# EAGLE schematic controller_rev3 (EAGLE 8.6.0)

## Sheet 1 of 3: Controller
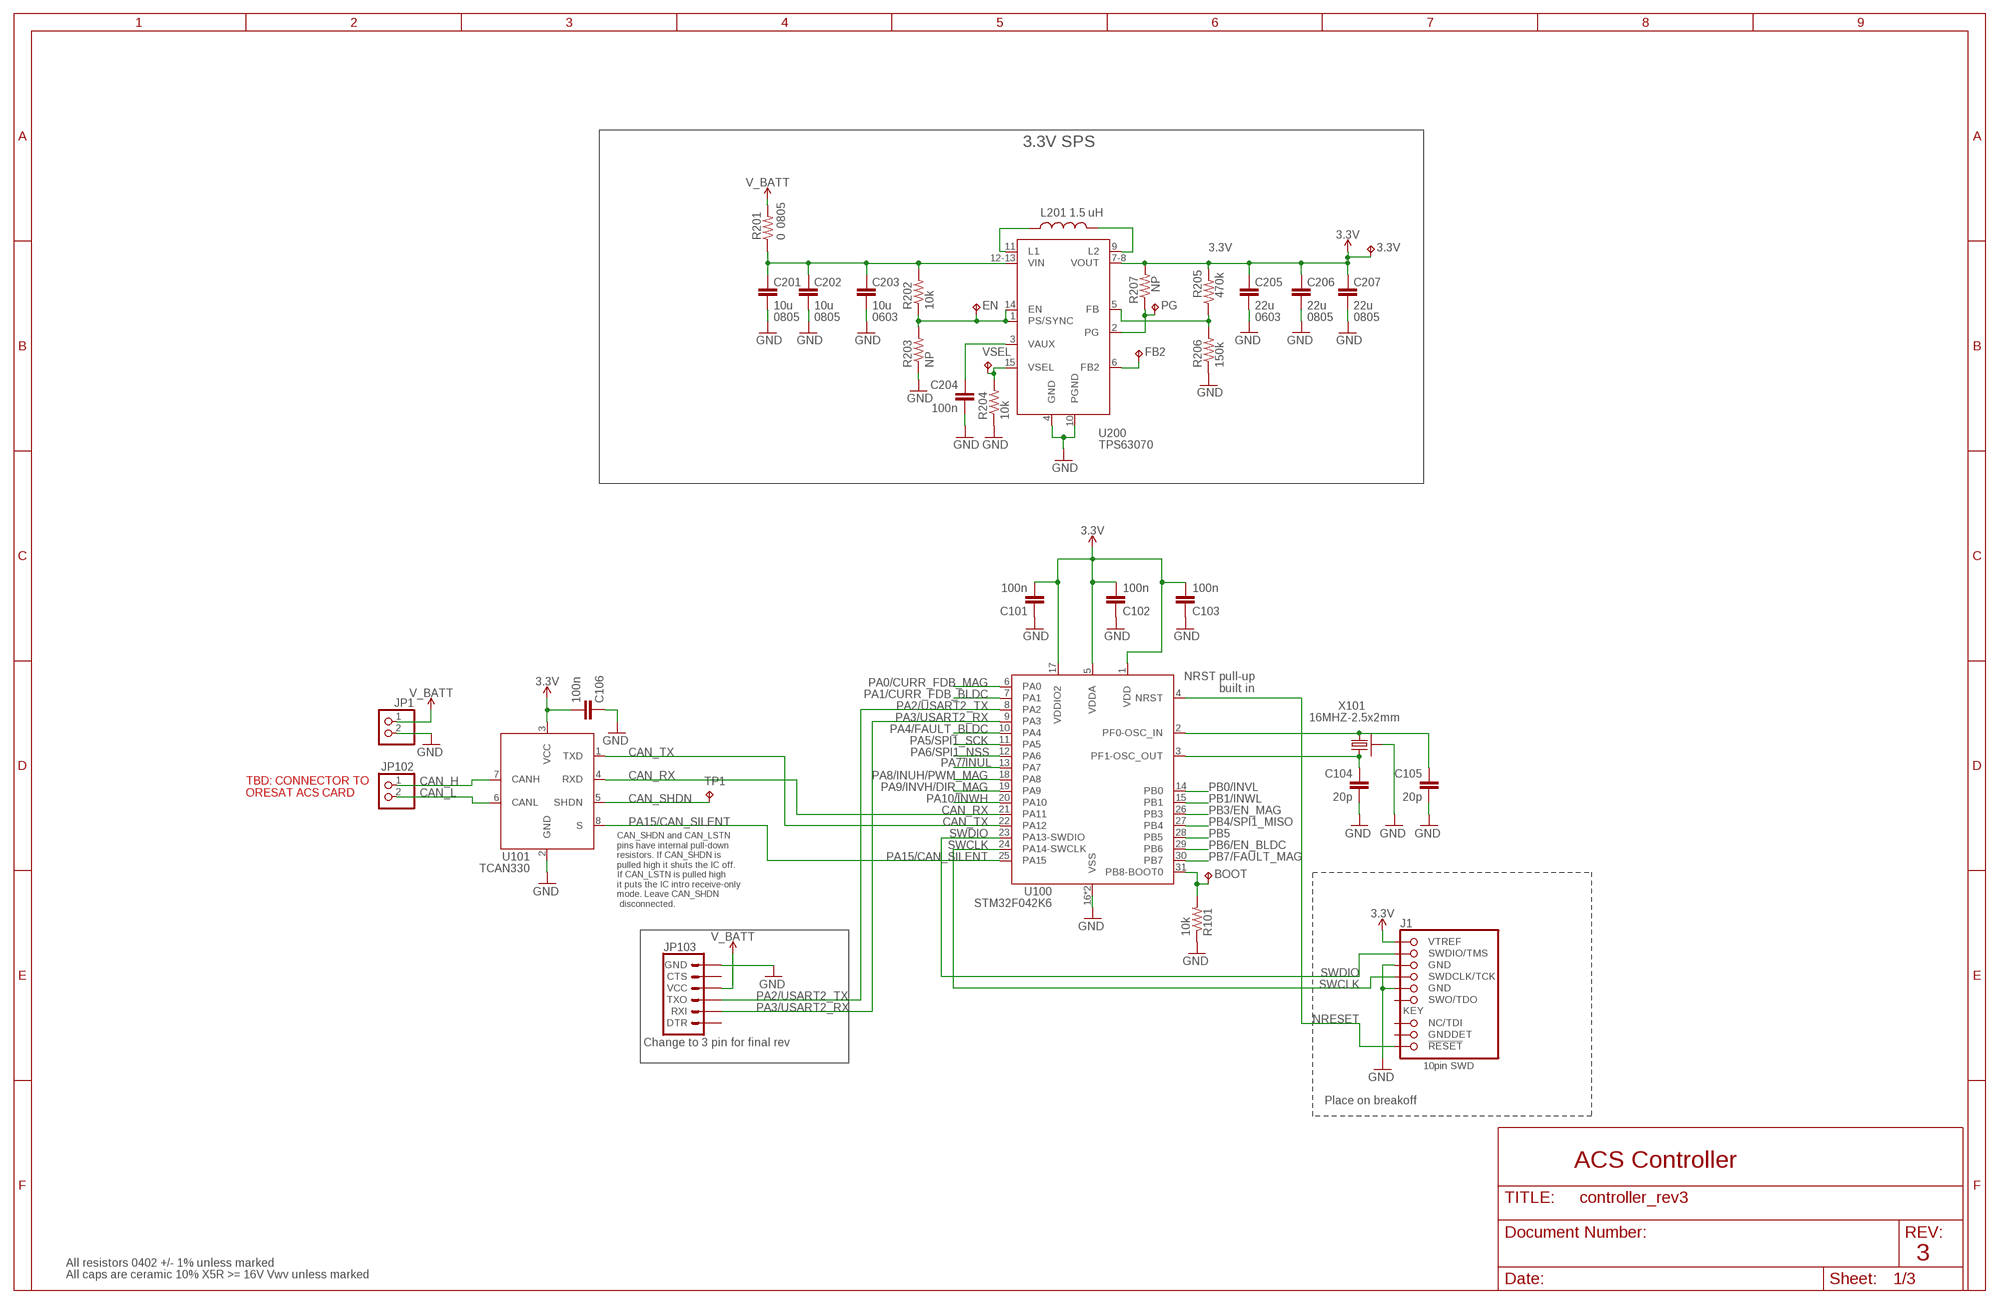
[diagram p0: schematic, sheet 1]

### Parts
3.3V  TPTP15SQ  [TP15SQ]
BOOT  TPTP15SQ  [TP15SQ]
C101  100n  C-EU0402-B-NOSILK  [.0402-B-NOSILK]
C102  100n  C-EU0402-B-NOSILK  [.0402-B-NOSILK]
C103  100n  C-EU0402-B-NOSILK  [.0402-B-NOSILK]
C104  20p  C-EU0402-B-NOSILK  [.0402-B-NOSILK]
C105  20p  C-EU0402-B-NOSILK  [.0402-B-NOSILK]
C106  100n  C-EU0402-B-NOSILK  [.0402-B-NOSILK]
C201  10u  C-EU0805-B-NOSILK  [.0805-B-NOSILK]
C202  10u  C-EU0805-B-NOSILK  [.0805-B-NOSILK]
C203  10u  C-EU0603-B-NOSILK  [.0603-B-NOSILK]
C204  100n  C-EU0402-B-NOSILK  [.0402-B-NOSILK]
C205  22u  C-EU0603-B-NOSILK  [.0603-B-NOSILK]
C206  22u  C-EU0805-B-NOSILK  [.0805-B-NOSILK]
C207  22u  C-EU0805-B-NOSILK  [.0805-B-NOSILK]
EN  TPTP15SQ  [TP15SQ]
FB2  TPTP15SQ  [TP15SQ]
J1  1.27MM-SWD-CONNECTOR  [1.27MM_2X5]
JP1  PINHD-1X2  [1X02]
JP102  PINHD-1X2  [1X02]
JP103  6_PIN_SERIAL_TARGETSILK  [6_PIN_SERIAL_TARGET_SIDE_W_SILK]
L201  1.5 uH  L-COILCRAFT-XFL4020  [L-COILCRAFT-XFL4020]
PG  TPTP15SQ  [TP15SQ]
R101  10k  R-US_0402-B-NOSILK  [.0402-B-NOSILK]
R201  0  R-US_0805-B-NOSILK  [.0805-B-NOSILK]
R202  10k  R-US_0402-B-NOSILK  [.0402-B-NOSILK]
R203  NP  R-US_0402-B-NOSILK  [.0402-B-NOSILK]
R204  10k  R-US_0402-B-NOSILK  [.0402-B-NOSILK]
R205  470k  R-US_0402-B-NOSILK  [.0402-B-NOSILK]
R206  150k  R-US_0402-B-NOSILK  [.0402-B-NOSILK]
R207  NP  R-US_0402-B-NOSILK  [.0402-B-NOSILK]
TP1  TPTP06R  [TP06R]
U100  STM32F042K6  [QFP32-7X7]
U101  TCAN330  [SOT23-8_TI-DCN]
U200  TPS63070  TPS63070X  [TPS63070X]
VSEL  TPTP15SQ  [TP15SQ]
X101  16MHZ-2.5x2mm  CRYSTAL-WITH-GND  [CRYSTAL_2.5X2]

### Nets
3.3V: 3.3V.TP C101.2 C102.2 C103.2 C106.2 C205.1 C206.1 C207.1 J1.VTREF R205.2 R207.2 U100.1(VDD) U100.5(VDDA) U100.17(VDDIO2) U101.3(VCC) U200.7-8(VOUT) ; also sheet 2,3
BOOT: BOOT.TP R101.2 U100.31(PB8-BOOT0)
CAN_H: JP102.1 U101.7(CANH)
CAN_L: JP102.2 U101.6(CANL)
CAN_RX: U100.21(PA11) U101.4(RXD)
CAN_SHDN: TP1.TP U101.5(SHDN)
CAN_TX: U100.22(PA12) U101.1(TXD)
CRYSTALIN: C105.1 U100.2(PF0-OSC_IN) X101.1
CRYSTALOUT: C104.1 U100.3(PF1-OSC_OUT) X101.3
GND: C101.1 C102.1 C103.1 C104.2 C105.2 C106.1 C201.2 C202.2 C203.2 C204.2 C205.2 C206.2 C207.2 J1.GND J1.GND@2(GND) JP1.2 JP103.P$6(GND) R101.1 R203.1 R204.1 R206.1 U100.16(VSS) U100.32(VSS) U101.2(GND) U200.4(GND) U200.10(PGND) X101.2(SHIELD) X101.4(SHIELD) ; also sheet 2,3
NRESET: J1.!RESET U100.4(NRST)
PA0/CURR_FDB_MAG: U100.6(PA0) ; also sheet 3
PA1/CURR_FDB_BLDC: U100.7(PA1) ; also sheet 2
PA2/USART2_TX: JP103.P$2(TXO) U100.8(PA2)
PA3/USART2_RX: JP103.P$3(RXI) U100.9(PA3)
PA4/FAULT_BLDC: U100.10(PA4) ; also sheet 2
PA5/SPI1_SCK: U100.11(PA5) ; also sheet 2
PA6/SPI1_NSS: U100.12(PA6) ; also sheet 2
PA7/INUL: U100.13(PA7) ; also sheet 2
PA8/INUH/PWM_MAG: U100.18(PA8) ; also sheet 2,3
PA9/INVH/DIR_MAG: U100.19(PA9) ; also sheet 2,3
PA10/INWH: U100.20(PA10) ; also sheet 2
PA15/CAN_SILENT: U100.25(PA15) U101.8(S)
PB0/INVL: U100.14(PB0) ; also sheet 2
PB1/INWL: U100.15(PB1) ; also sheet 2
PB3/EN_MAG: U100.26(PB3) ; also sheet 3
PB4/SPI1_MISO: U100.27(PB4) ; also sheet 2
PB5: U100.28(PB5)
PB6/EN_BLDC: U100.29(PB6) ; also sheet 2
PB7/FAULT_MAG: U100.30(PB7) ; also sheet 3
SWCLK: J1.SWDCLK(SWDCLK/TCK) U100.24(PA14-SWCLK)
SWDIO: J1.SWDIO(SWDIO/TMS) U100.23(PA13-SWDIO)
TPS-EN: EN.TP R202.1 R203.2 U200.1(PS/SYNC) U200.14(EN)
TPS-FB: R205.1 R206.2 U200.5(FB)
TPS-L1: L201.1 U200.11(L1)
TPS-L2: L201.2 U200.9(L2)
TPS-PG: PG.TP R207.1 U200.2(PG)
TPS-VAUX: C204.1 U200.3(VAUX)
TPS-VIN: C201.1 C202.1 C203.1 R201.1 R202.2 U200.12-13(VIN)
TSP-FB2: FB2.TP U200.6(FB2)
TSP-VSEL: R204.2 U200.15(VSEL) VSEL.TP
V_BATT: JP1.1 JP103.P$4(VCC) R201.2 ; also sheet 2,3
Unconnected: J1.GNDDET J1.NC(NC/TDI) J1.SWO(SWO/TDO) JP103.P$1(DTR) JP103.P$5(CTS)

### Notes on the sheet
- 3.3V SPS
- 0805
- 0805 | 0805 | 0603 | 0603 | 0805 | 0805
- NRST pull-up
  built in
- TBD: CONNECTOR TO 
  ORESAT ACS CARD
- CAN_SHDN and CAN_LSTN
  pins have internal pull-down
  resistors. If CAN_SHDN is 
  pulled high it shuts the IC off.
  If CAN_LSTN is pulled high
  it puts the IC intro receive-only
  mode. Leave CAN_SHDN
   disconnected.
- Change to 3 pin for final rev
- Place on breakoff
- ACS Controller
- 3
- All resistors 0402 +/- 1% unless marked
- All caps are ceramic 10% X5R >= 16V Vwv unless marked

## Sheet 2 of 3: Reaction Wheel
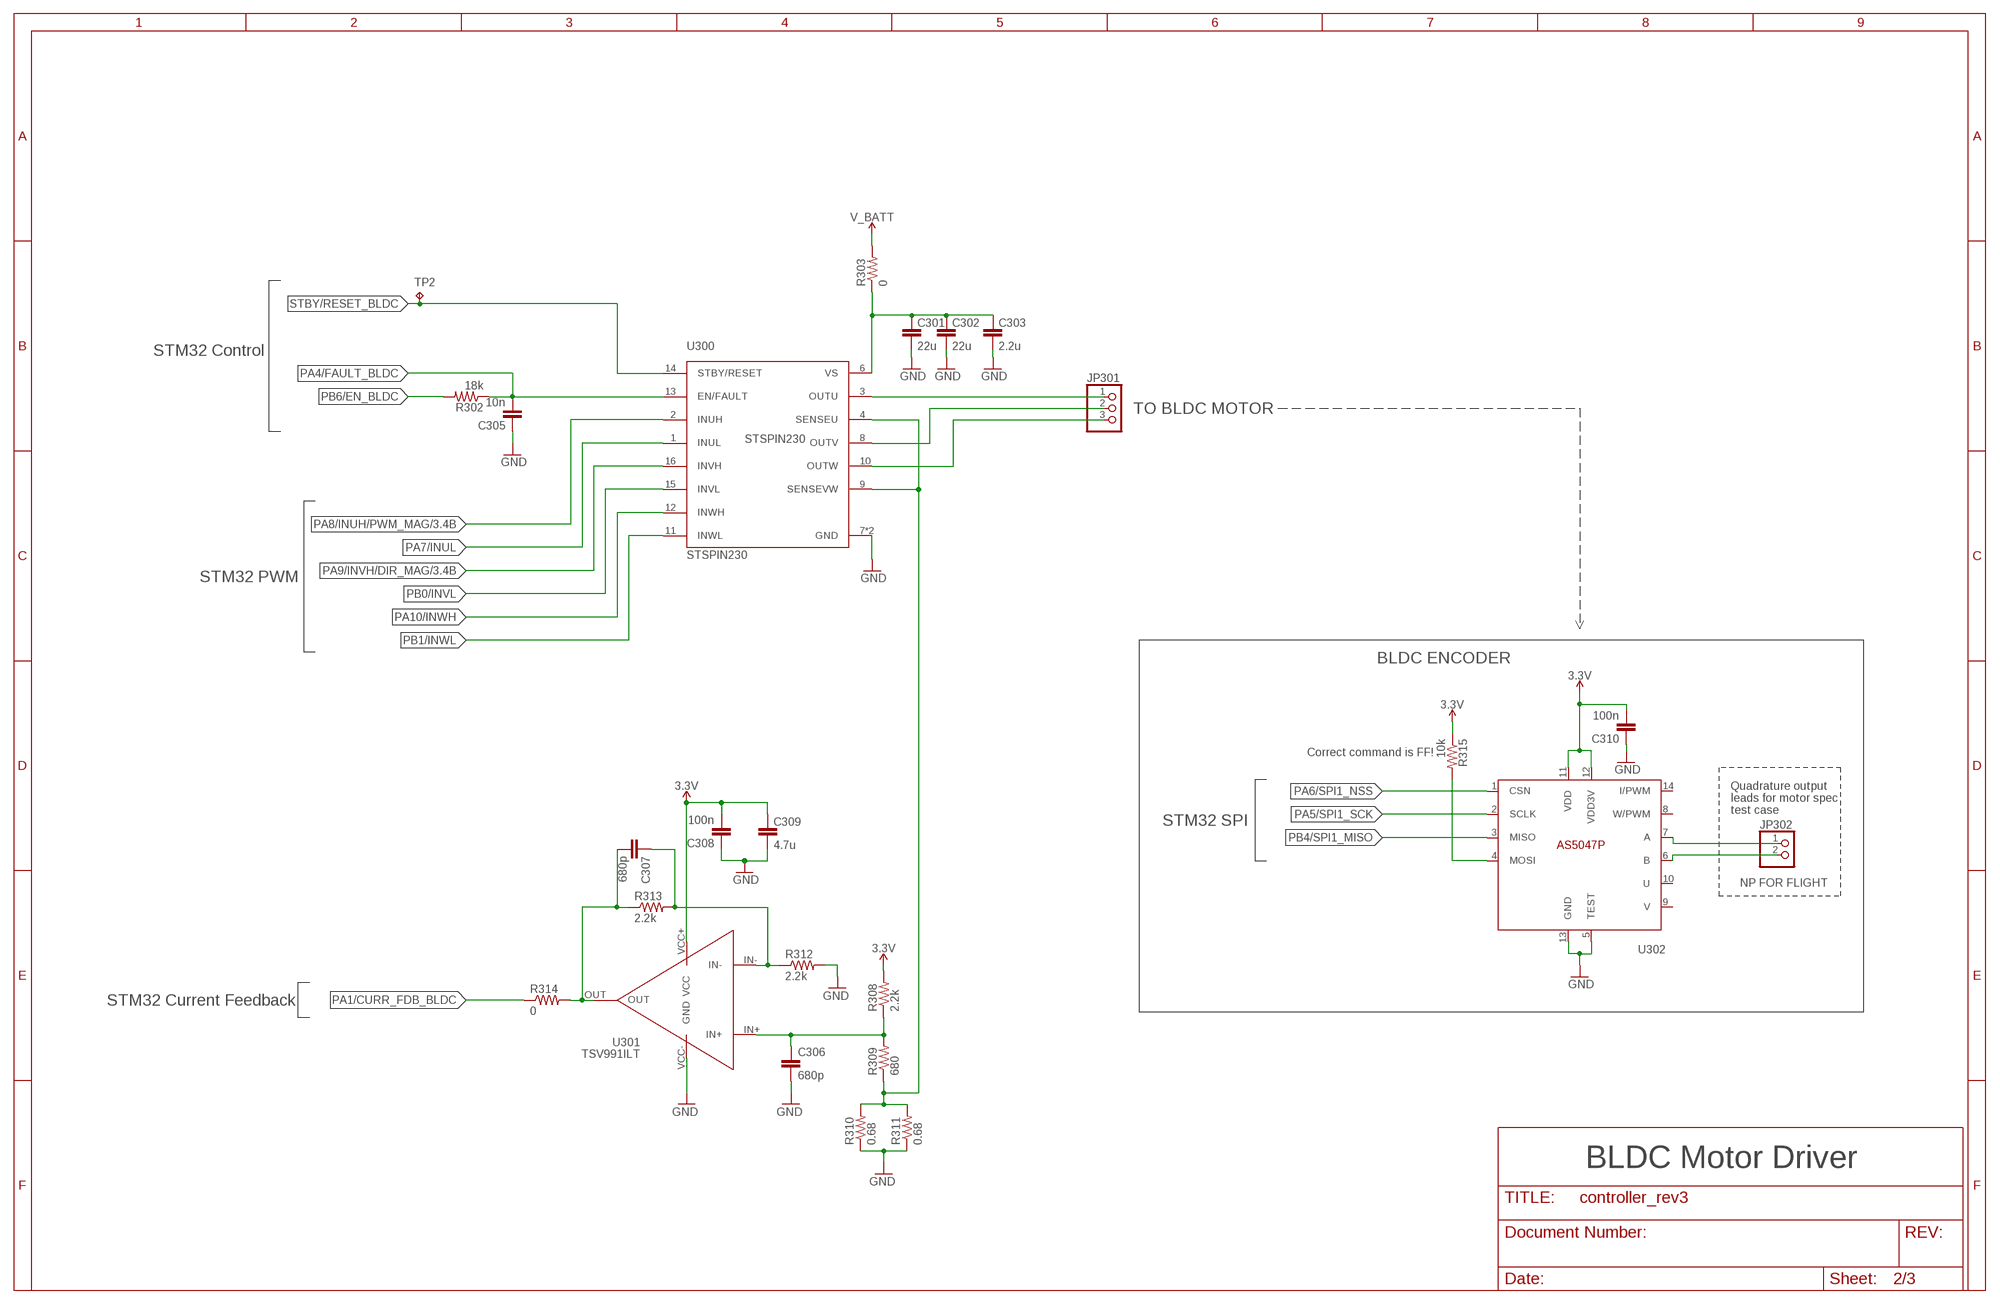
[diagram p1: schematic, sheet 2]

### Parts
C301  22u  C-EU0603-B-NOSILK  [.0603-B-NOSILK]
C302  22u  C-EU0603-B-NOSILK  [.0603-B-NOSILK]
C303  2.2u  C-EU0603-B-NOSILK  [.0603-B-NOSILK]
C305  10n  C-EU0402-B-NOSILK  [.0402-B-NOSILK]
C306  680p  C-EU0402-B-NOSILK  [.0402-B-NOSILK]
C307  680p  C-EU0402-B-NOSILK  [.0402-B-NOSILK]
C308  100n  C-EU0402-B-NOSILK  [.0402-B-NOSILK]
C309  4.7u  C-EU0603-B-NOSILK  [.0603-B-NOSILK]
C310  100n  C-EU0402-B-NOSILK  [.0402-B-NOSILK]
JP301  PINHD-1X03_2.00  [1X03M]
JP302  PINHD-1X2  [1X02]
R302  18k  R-US_0402-B-NOSILK  [.0402-B-NOSILK]
R303  0  R-US_0805-B-NOSILK  [.0805-B-NOSILK]
R308  2.2k  R-US_0402-B-NOSILK  [.0402-B-NOSILK]
R309  680  R-US_0402-B-NOSILK  [.0402-B-NOSILK]
R310  0.68  R-US_0805-B-NOSILK  [.0805-B-NOSILK]
R311  0.68  R-US_0805-B-NOSILK  [.0805-B-NOSILK]
R312  2.2k  R-US_0402-B-NOSILK  [.0402-B-NOSILK]
R313  2.2k  R-US_0402-B-NOSILK  [.0402-B-NOSILK]
R314  0  R-US_0402-B-NOSILK  [.0402-B-NOSILK]
R315  10k  R-US_0402-B-NOSILK  [.0402-B-NOSILK]
TP2  TPTP06R  [TP06R]
U300  STSPIN230  [VFQFPN]
U301  TSV991ILT  [SOT23-5]
U302  AS5047P  [TSSOP14]

### Nets
3.3V: C308.2 C309.1 C310.2 R308.2 R315.1 U301.VCC+(VCC) U302.11(VDD) U302.12(VDD3V) ; also sheet 1,3
AS5047_MOSI: R315.2 U302.4(MOSI)
BLDC-I-IN+: C306.1 R308.1 R309.2 U301.IN+
BLDC-I-IN-: C307.1 R312.1 R313.2 U301.IN-
BLDC-I-OUT: C307.2 R313.1 R314.2 U301.OUT
GND: C301.2 C302.2 C303.2 C305.1 C306.2 C308.1 C309.2 C310.1 R310.1 R311.1 R312.2 U300.7(GND) U300.EPAD(GND) U301.VCC-(GND) U302.5(TEST) U302.13(GND) ; also sheet 1,3
N$7: C301.1 C302.1 C303.1 R303.1 U300.6(VS)
PA1/CURR_FDB_BLDC: R314.1 ; also sheet 1
PA4/FAULT_BLDC: C305.2 R302.1 U300.13(EN/FAULT) ; also sheet 1
PA5/SPI1_SCK: U302.2(SCLK) ; also sheet 1
PA6/SPI1_NSS: U302.1(CSN) ; also sheet 1
PA7/INUL: U300.1(INUL) ; also sheet 1
PA8/INUH/PWM_MAG: U300.2(INUH) ; also sheet 1,3
PA9/INVH/DIR_MAG: U300.16(INVH) ; also sheet 1,3
PA10/INWH: U300.12(INWH) ; also sheet 1
PB0/INVL: U300.15(INVL) ; also sheet 1
PB1/INWL: U300.11(INWL) ; also sheet 1
PB4/SPI1_MISO: U302.3(MISO) ; also sheet 1
PB6/EN_BLDC: R302.2 ; also sheet 1
QUAD_A: JP302.1 U302.7(A)
QUAD_B: JP302.2 U302.6(B)
SENSE_BLDC: R309.1 R310.2 R311.2 U300.4(SENSEU) U300.9(SENSEVW)
STBY/RESET_BLDC: TP2.TP U300.14(STBY/RESET)
U: JP301.1 U300.3(OUTU)
V: JP301.2 U300.8(OUTV)
V_BATT: R303.2 ; also sheet 1,3
W: JP301.3 U300.10(OUTW)
Unconnected: U302.8(W/PWM) U302.9(V) U302.10(U) U302.14(I/PWM)

### Notes on the sheet
- STM32 Control
- TO BLDC MOTOR
- STM32 PWM
- BLDC ENCODER
- Correct command is FF!
- Quadrature output
  leads for motor spec
  test case
- STM32 SPI
- NP FOR FLIGHT
- STM32 Current Feedback
- BLDC Motor Driver

## Sheet 3 of 3: Magnetorquer
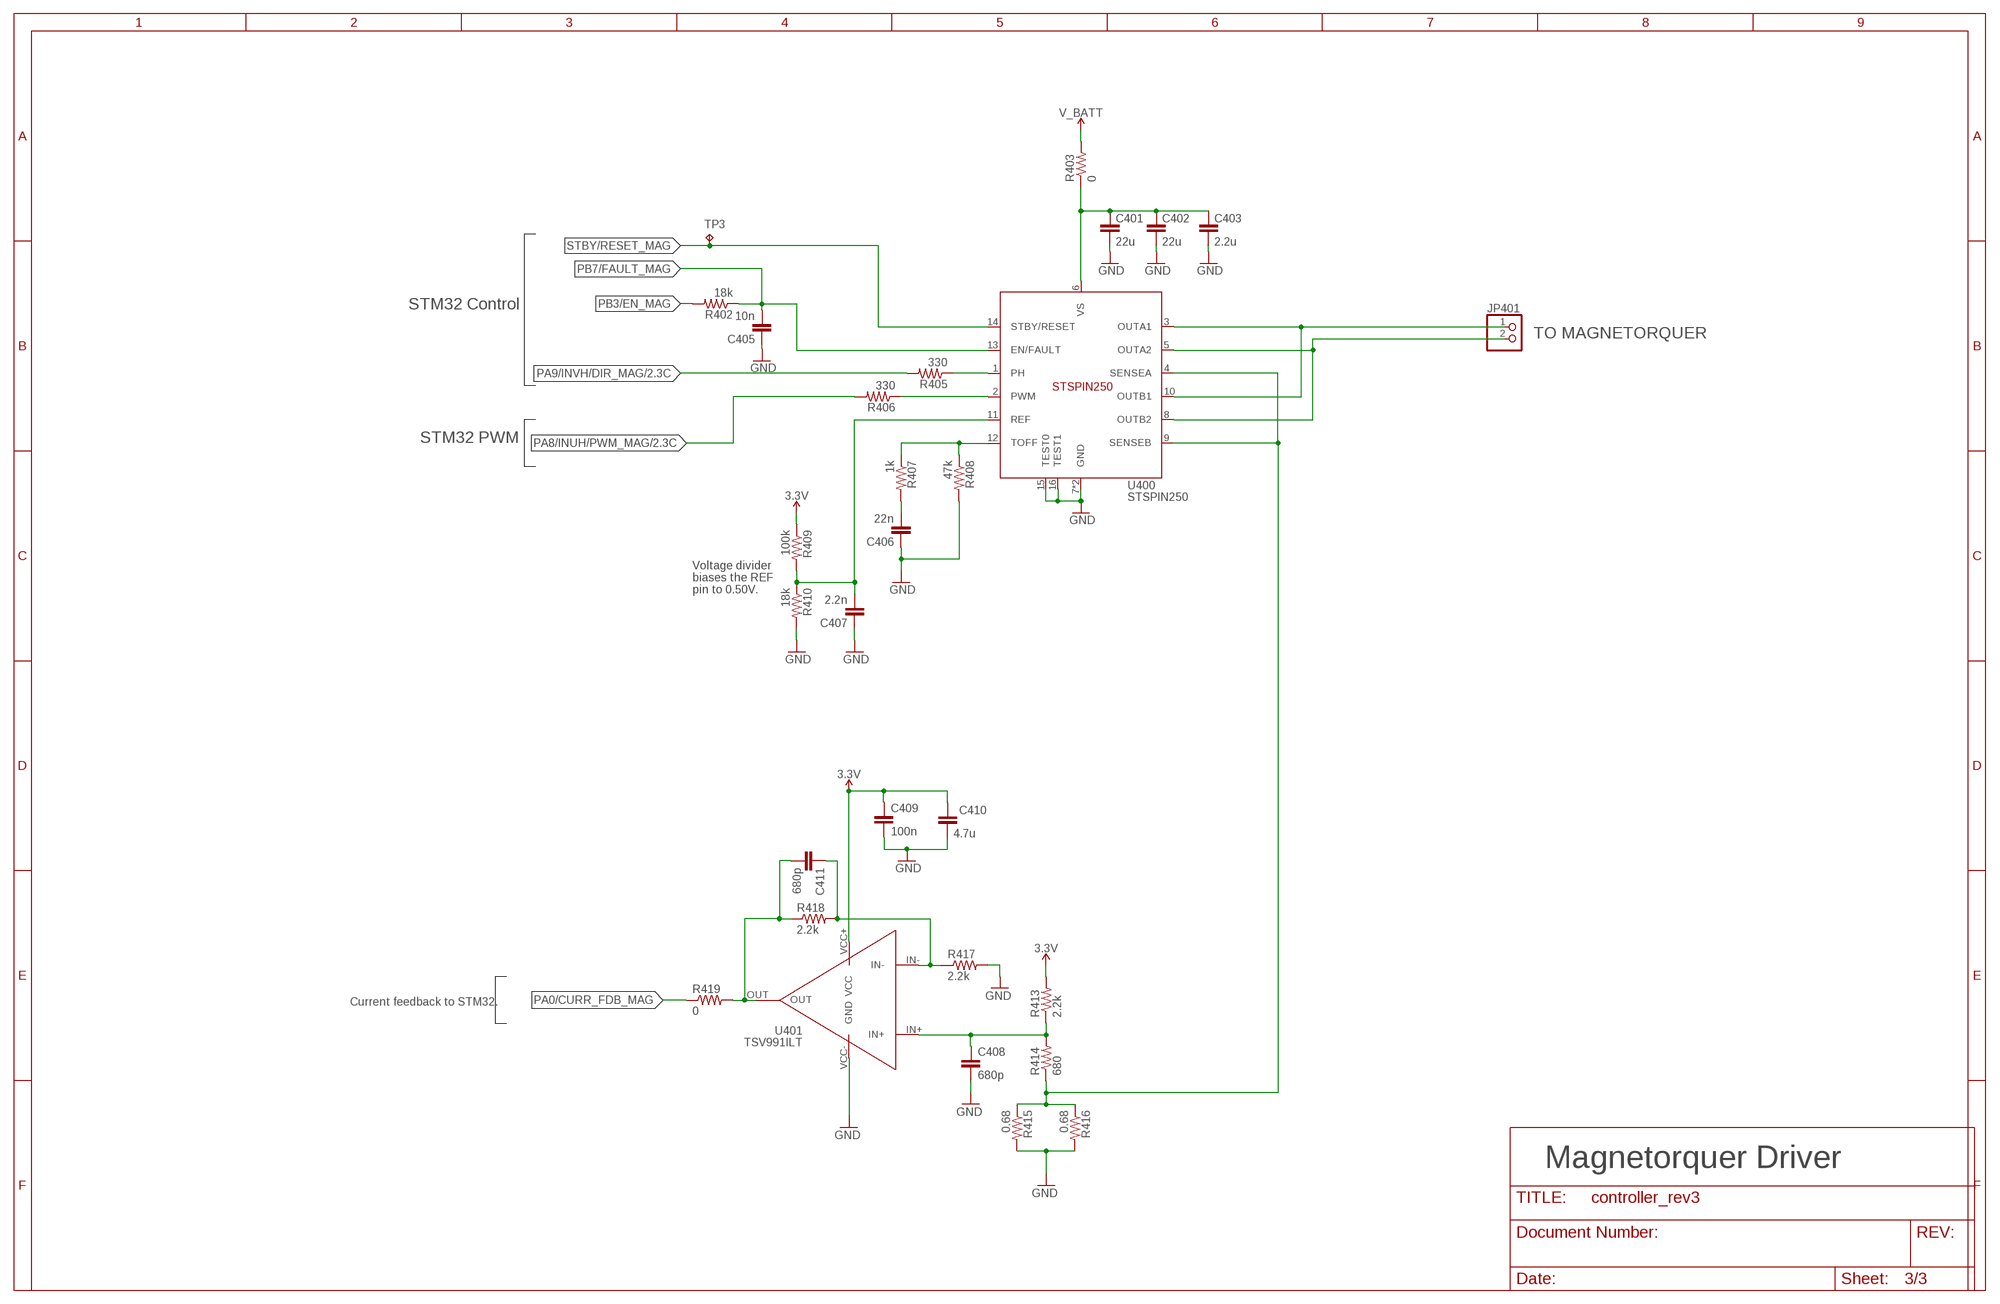
[diagram p2: schematic, sheet 3]

### Parts
C401  22u  C-EU0603-B-NOSILK  [.0603-B-NOSILK]
C402  22u  C-EU0603-B-NOSILK  [.0603-B-NOSILK]
C403  2.2u  C-EU0603-B-NOSILK  [.0603-B-NOSILK]
C405  10n  C-EU0402-B-NOSILK  [.0402-B-NOSILK]
C406  22n  C-EU0402-B-NOSILK  [.0402-B-NOSILK]
C407  2.2n  C-EU0402-B-NOSILK  [.0402-B-NOSILK]
C408  680p  C-EU0402-B-NOSILK  [.0402-B-NOSILK]
C409  100n  C-EU0402-B-NOSILK  [.0402-B-NOSILK]
C410  4.7u  C-EU0603-B-NOSILK  [.0603-B-NOSILK]
C411  680p  C-EU0402-B-NOSILK  [.0402-B-NOSILK]
JP401  PINHD-1X2  [1X02]
R402  18k  R-US_0402-B-NOSILK  [.0402-B-NOSILK]
R403  0  R-US_0805-B-NOSILK  [.0805-B-NOSILK]
R405  330  R-US_0402-B-NOSILK  [.0402-B-NOSILK]
R406  330  R-US_0402-B-NOSILK  [.0402-B-NOSILK]
R407  1k  R-US_0402-B-NOSILK  [.0402-B-NOSILK]
R408  47k  R-US_0402-B-NOSILK  [.0402-B-NOSILK]
R409  100k  R-US_0402-B-NOSILK  [.0402-B-NOSILK]
R410  18k  R-US_0402-B-NOSILK  [.0402-B-NOSILK]
R413  2.2k  R-US_0402-B-NOSILK  [.0402-B-NOSILK]
R414  680  R-US_0402-B-NOSILK  [.0402-B-NOSILK]
R415  0.68  R-US_0805-B-NOSILK  [.0805-B-NOSILK]
R416  0.68  R-US_0805-B-NOSILK  [.0805-B-NOSILK]
R417  2.2k  R-US_0402-B-NOSILK  [.0402-B-NOSILK]
R418  2.2k  R-US_0402-B-NOSILK  [.0402-B-NOSILK]
R419  0  R-US_0402-B-NOSILK  [.0402-B-NOSILK]
TP3  TPTP06R  [TP06R]
U400  STSPIN250  [VFQPN]
U401  TSV991ILT  [SOT23-5]

### Nets
3.3V: C409.1 C410.1 R409.1 R413.2 U401.VCC+(VCC) ; also sheet 1,2
250_REF: C407.2 R409.2 R410.1 U400.11(REF)
250_TOFF: R407.1 R408.1 U400.12(TOFF)
GND: C401.2 C402.2 C403.2 C405.1 C406.1 C407.1 C408.2 C409.2 C410.2 R408.2 R410.2 R415.2 R416.2 R417.2 U400.7(GND) U400.15(TEST0) U400.16(TEST1) U400.EPAD(GND) U401.VCC-(GND) ; also sheet 1,2
MAG-I-IN+: C408.1 R413.1 R414.2 U401.IN+
MAG-I-IN-: C411.1 R417.1 R418.2 U401.IN-
MAG-I-OUT: C411.2 R418.1 R419.2 U401.OUT
N$2: C406.2 R407.2
N$3: R406.1 U400.2(PWM)
N$5: R405.1 U400.1(PH)
N$8: C401.1 C402.1 C403.1 R403.1 U400.6(VS)
OUT1: JP401.1 U400.3(OUTA1) U400.10(OUTB1)
OUT2: JP401.2 U400.5(OUTA2) U400.8(OUTB2)
PA0/CURR_FDB_MAG: R419.1 ; also sheet 1
PA8/INUH/PWM_MAG: R406.2 ; also sheet 1,2
PA9/INVH/DIR_MAG: R405.2 ; also sheet 1,2
PB3/EN_MAG: R402.2 ; also sheet 1
PB7/FAULT_MAG: C405.2 R402.1 U400.13(EN/FAULT) ; also sheet 1
SENSE_MAG: R414.1 R415.1 R416.1 U400.4(SENSEA) U400.9(SENSEB)
STBY/RESET_MAG: TP3.TP U400.14(STBY/RESET)
V_BATT: R403.2 ; also sheet 1,2

### Notes on the sheet
- STM32 Control
- TO MAGNETORQUER
- STM32 PWM
- Voltage divider
  biases the REF
  pin to 0.50V.
- Current feedback to STM32.
- Magnetorquer Driver

## Library data of the parts
3.3V BOOT EN FB2 PG TP1-TP3 VSEL = testpad:TP: Test pad
C101-C103 C106 C204 C305-C308 C310 C405-C409 C411 = rcl_custom:C-EU: CAPACITOR, European symbol; DIS: Digi-Key; DPN: 1276-1001-1-ND; MFR: Samsung; MPN: CL05B104KO5NNNC
C104 C105 = rcl_custom:C-EU: CAPACITOR, European symbol; DIS: Digi-Key; DPN: 1276-6601-1-ND; MFR: Samsung; MPN: CL05C200JB51PNC
C201 C202 C206 C207 = oresat-rcl:C-EU: CAPACITOR, European symbol
C203 C205 C301-C303 C309 C401-C403 C410 = oresat-rcl:C-EU: CAPACITOR, European symbol; DIS: Digi-Key; DPN: 1276-1001-1-ND; MFR: Samsung; MPN: CL05B104KO5NNNC
J1 = J-CNC-3220-10-0100-00-ARM-SWD-port:1.27MM-SWD-CONNECTOR: ARM SWD Programming Header. Example part is the CNC 3220-10-0100-00
JP1 JP102 JP302 JP401 = pinhead:PINHD-1X2: PIN HEADER
JP103 = SparkFun-Connectors:6_PIN_SERIAL_TARGET: 6-pin header connection for use with the "FTDI BASIC" pinout - TARGET SIDE. Also known as "Arduino Serial Program Header". It is used to mate with our FTDI Basic serial programmers using the Arduino IDE. Note, this device has "TARGET" in the name. It is intended to be used on a design that contains a target micro-controller that you wish to program. The "sister" device, named "CABLE" is inteneded to be used on a design that usually lives on the end of your USB cable and prvides the converter chip (FTDI232 or FTDI231x) to commnicate serial RX/TX. You can populate with some of these: Break Away Headers - Straight <https://www.sparkfun.com/products/116> (PRT-00116) For reference (or to suit your programming needs) check out these designs: SparkFun FTDI Basic Breakout - 5V <https://www.sparkfun.com/products/9716> (DEV-09716) SparkFun FTDI Basic Breakout - 3.3V <https://www.sparkfun.com/products/9873> (DEV-09873) SparkFun FTDI SmartBasic <https://www.sparkfun.com/products/12935> (DEV-12935) SparkFun Beefy 3 - FTDI Basic Breakout <https://www.sparkfun.com/products/13746> (DEV-13746)
JP301 = pinhead-2:PINHD-1X03: PIN HEADER
L201 = L-Coilcraft-XFL4020:L-COILCRAFT-XFL4020; DIS: Mouser; DPN: 994-XFL4020-152MEB; MFR: Coilcraft; MPN: XFL4020-152ME
R101 R202-R207 R302 R308 R309 R312-R315 R402 R405-R410 R413 R414 R417-R419 = rcl_custom:R-US_: RESISTOR, American symbol; DIS: Digi-Key; DPN: 1276-4275-1-ND; MFR: Samsung; MPN: RC1005F6653CS
R201 = rcl_custom:R-US_: RESISTOR, American symbol; DIS: Digi-Key; DPN: RHM0.0ARCT-ND; MFR: Rohm; MPN: MCR10EZPJ000
R303 R310 R311 R403 R415 R416 = oresat-rcl:R-US_: RESISTOR, American symbol
U100 = STM32F042K:STM32F042K6; DIS: Digi-Key; DPN: STM32F042K6T7-ND; MFR: STMicroelectronics; MPN: STM32F042K6T7
U101 = TCAN330:TCAN330; DIS: Digi-Key; DPN: 296-44211-1-ND; MFR: Texas Instruments; MPN: TCAN330GDCNT
U200 = ic-pwr-tps63070x:TPS63070X: TPS63070 2-V to 16-V Buck-Boost Converter With 3.6-A Switch Current
U300 = U-ST-STSPIN230-BLDC-controller:STSPIN230
U301 U401 = TSV991ILT:TSV991ILT
U302 = U-AMS-AS5047P-encoder:AS5047P
U400 = U-ST-STSPIN250-Brushed-DC-controller:STSPIN250
X101 = low-gain-radio:CRYSTAL-WITH-GND; DIS: Digi-Key; DPN: XC2181CT-ND; MFR: ECS Inc.; MPN: ECS-160-10-36Q-ES-TR